# EAGLE design ratatouille (EAGLE 9.6.2)
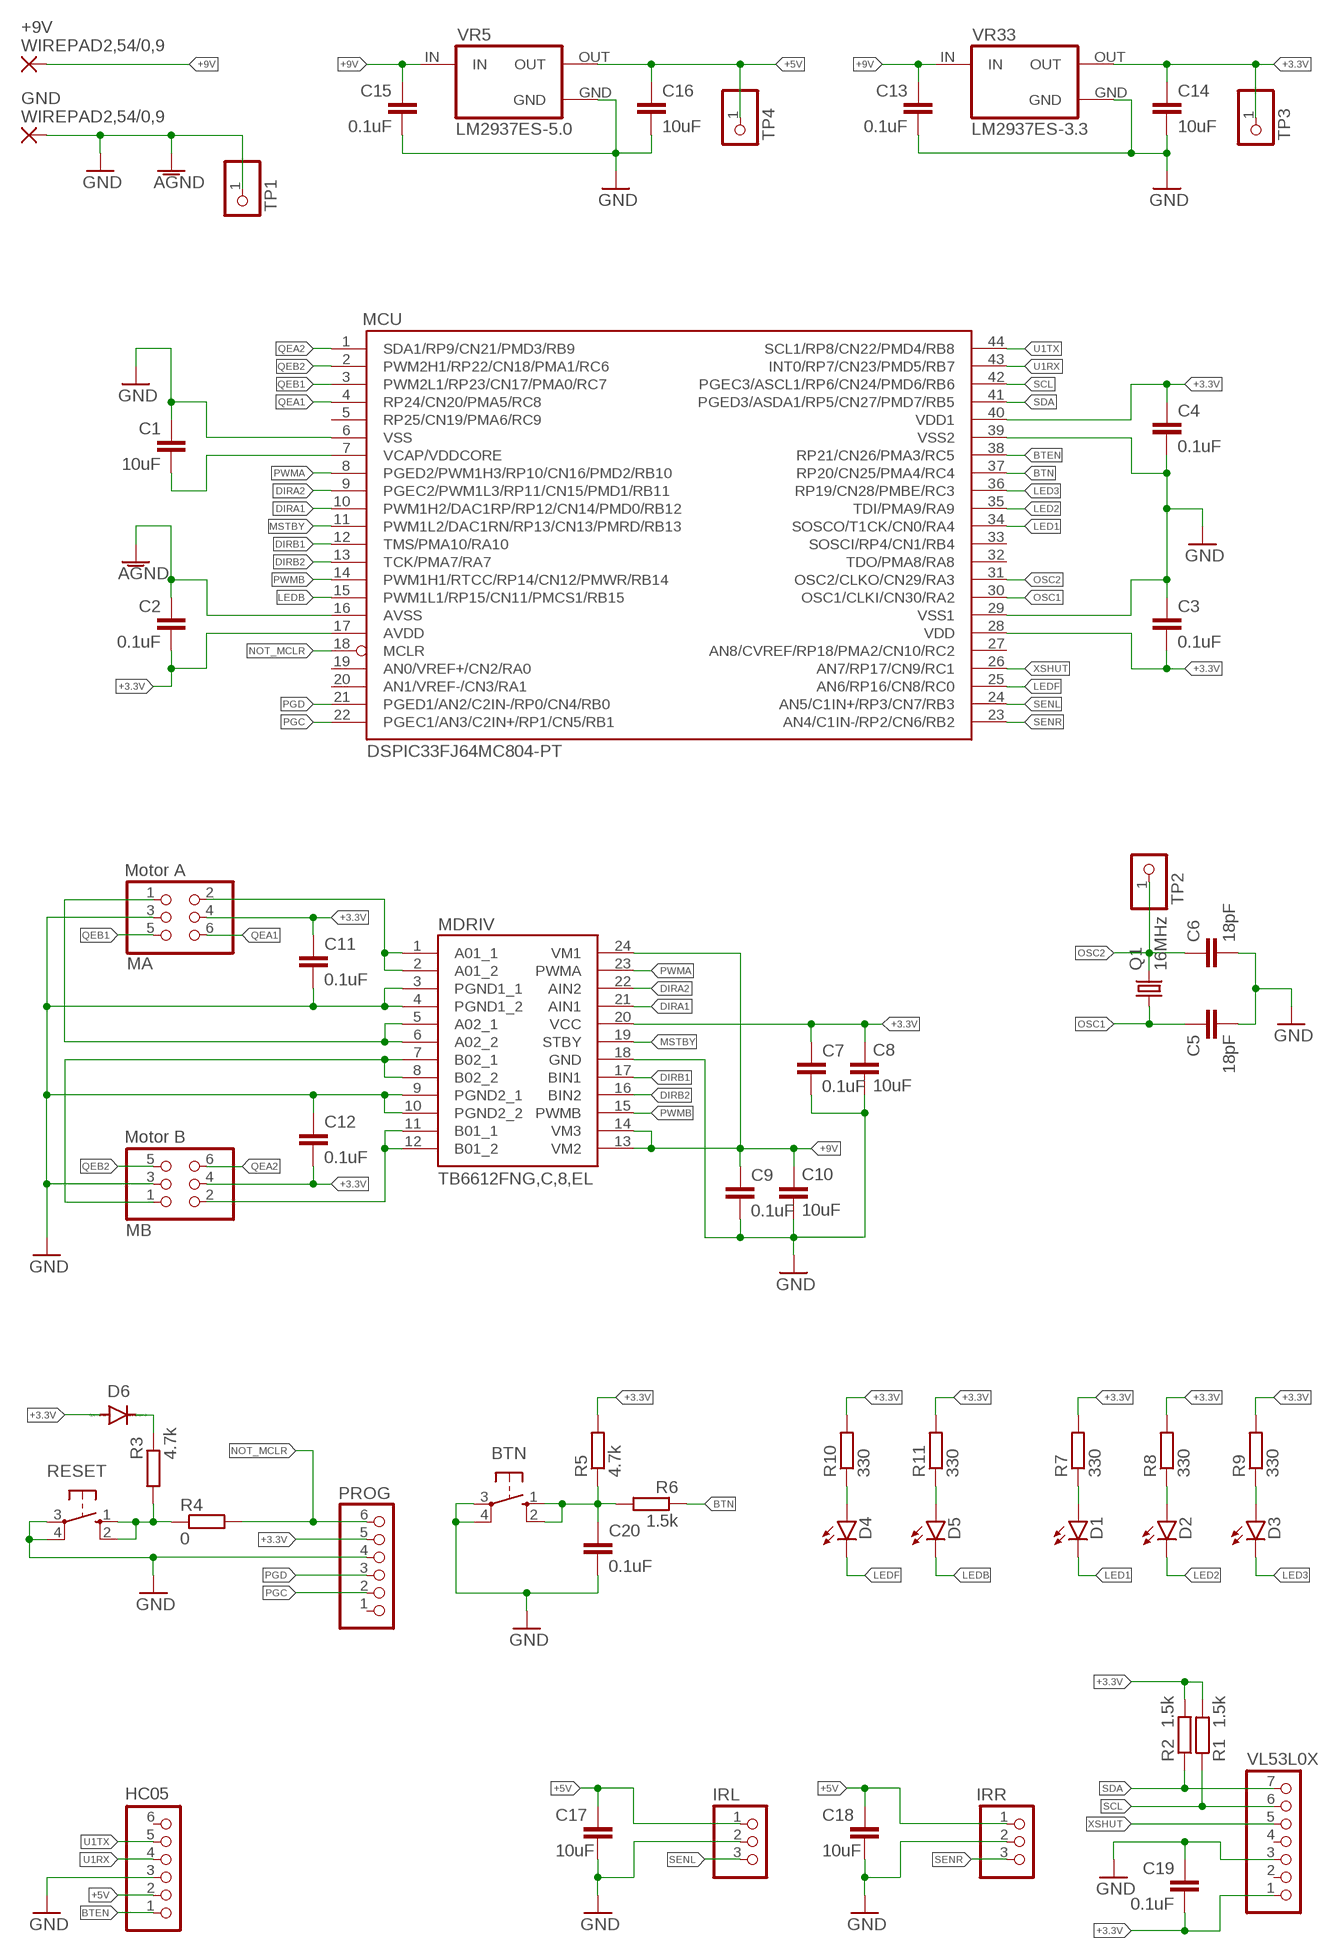
[diagram p0: schematic, sheet 1]

## Parts
+9V  WIREPAD2,54/0,9  [2,54/0,9]
BTN  10-XX  [B3F-10XX]
C1  10uF  C-EUC3216  [C3216]
C2  0.1uF  C-EUC0805  [C0805]
C3  0.1uF  C-EUC0805  [C0805]
C4  0.1uF  C-EUC0805  [C0805]
C5  18pF  C-EUC0805  [C0805]
C6  18pF  C-EUC0805  [C0805]
C7  0.1uF  C-EUC0805  [C0805]
C8  10uF  C-EUC3216  [C3216]
C9  0.1uF  C-EUC0805  [C0805]
C10  10uF  C-EUC3216  [C3216]
C11  0.1uF  C-EUC0805  [C0805]
C12  0.1uF  C-EUC0805  [C0805]
C13  0.1uF  C-EUC0805  [C0805]
C14  10uF  C-EUC3216  [C3216]
C15  0.1uF  C-EUC0805  [C0805]
C16  10uF  C-EUC3216  [C3216]
C17  10uF  C-EUC0805  [C0805]
C18  10uF  C-EUC0805  [C0805]
C19  0.1uF  C-EUC0805  [C0805]
C20  0.1uF  C-EUC0805  [C0805]
D1  LEDCHIP-LED0805  [CHIP-LED0805]
D2  LEDCHIP-LED0805  [CHIP-LED0805]
D3  LEDCHIP-LED0805  [CHIP-LED0805]
D4  LED3MM  [LED3MM]
D5  LED3MM  [LED3MM]
D6  DIODE-SOD123  [SOD123]
GND  WIREPAD2,54/0,9  [2,54/0,9]
HC05  PINHD-1X6  [1X06]
IRL  PINHD-1X3  [1X03]
IRR  PINHD-1X3  [1X03]
MA  PINHD-2X3  [2X03]
MB  PINHD-2X3  [2X03]
MCU  DSPIC33FJ64MC804-PT  [TQFP44]
MDRIV  TB6612FNG,C,8,EL  [SOP65P760X160-24N]
PROG  PINHD-1X6/90  [1X06/90]
Q1  16MHz  CRYSTALHC49U-V  [HC49U-V]
R1  1.5k  R-EU_R0805  [R0805]
R2  1.5k  R-EU_R0805  [R0805]
R3  4.7k  R-EU_R0805  [R0805]
R4  0  R-EU_R0805  [R0805]
R5  4.7k  R-EU_R0805  [R0805]
R6  1.5k  R-EU_R0805  [R0805]
R7  330  R-EU_R0805  [R0805]
R8  330  R-EU_R0805  [R0805]
R9  330  R-EU_R0805  [R0805]
R10  330  R-EU_R0805  [R0805]
R11  330  R-EU_R0805  [R0805]
RESET  10-XX  [B3F-10XX]
TP1  PINHD-1X1  [1X01]
TP2  PINHD-1X1  [1X01]
TP3  PINHD-1X1  [1X01]
TP4  PINHD-1X1  [1X01]
VL53L0X  PINHD-1X7  [1X07]
VR5  LM2937ES-5.0  [TO263]
VR33  LM2937ES-3.3  [TO263]

## Nets
+3.3V [power]: C2.1 C3.1 C4.1 C7.1 C8.1 C11.2 C12.2 C14.1 C19.1 D6.A MA.4 MB.4 MCU.17(AVDD) MCU.28(VDD) MCU.40(VDD1) MDRIV.20(VCC) PROG.5 R1.2 R2.2 R5.2 R7.2 R8.2 R9.2 R10.2 R11.2 TP3.1 VL53L0X.1 VR33.OUT
+5V [power]: C16.1 C17.1 C18.1 HC05.2 IRL.1 IRR.1 TP4.1 VR5.OUT
+9V [power]: +9V.1(P) C9.1 C10.1 C13.1 C15.1 MDRIV.13(VM2) MDRIV.14(VM3) MDRIV.24(VM1) VR5.IN VR33.IN
BTEN: HC05.1 MCU.38(RP21/CN26/PMA3/RC5)
BTN: MCU.37(RP20/CN25/PMA4/RC4) R6.1
DIRA1: MCU.10(PWM1H2/DAC1RP/RP12/CN14/PMD0/RB12) MDRIV.21(AIN1)
DIRA2: MCU.9(PGEC2/PWM1L3/RP11/CN15/PMD1/RB11) MDRIV.22(AIN2)
DIRB1: MCU.12(TMS/PMA10/RA10) MDRIV.17(BIN1)
DIRB2: MCU.13(TCK/PMA7/RA7) MDRIV.16(BIN2)
GND [power]: BTN.3(P) BTN.4(P1) C1.2 C2.2 C3.2 C4.2 C5.1 C6.1 C7.2 C8.2 C9.2 C10.2 C11.1 C12.1 C13.2 C14.2 C15.2 C16.2 C17.2 C18.2 C19.2 C20.2 GND.1(P) HC05.3 IRL.2 IRR.2 MA.3 MB.3 MCU.6(VSS) MCU.16(AVSS) MCU.29(VSS1) MCU.39(VSS2) MDRIV.3(PGND1_1) MDRIV.4(PGND1_2) MDRIV.9(PGND2_1) MDRIV.10(PGND2_2) MDRIV.18(GND) PROG.4 RESET.3(P) RESET.4(P1) TP1.1 VL53L0X.3 VR5.GND VR33.GND ; supply symbol labelled AGND
LED1: D1.C MCU.34(SOSCO/T1CK/CN0/RA4)
LED2: D2.C MCU.35(TDI/PMA9/RA9)
LED3: D3.C MCU.36(RP19/CN28/PMBE/RC3)
LEDB: D5.K(C) MCU.15(PWM1L1/RP15/CN11/PMCS1/RB15)
LEDF: D4.K(C) MCU.25(AN6/RP16/CN8/RC0)
MSTBY: MCU.11(PWM1L2/DAC1RN/RP13/CN13/PMRD/RB13) MDRIV.19(STBY)
N$1: BTN.1(S) BTN.2(S1) C20.1 R5.1 R6.2
N$2: R3.1 R4.1 RESET.1(S) RESET.2(S1)
N$3: D2.A R8.1
N$4: MA.2 MDRIV.1(A01_1) MDRIV.2(A01_2)
N$5: D1.A R7.1
N$6: MA.1 MDRIV.5(A02_1) MDRIV.6(A02_2)
N$7: D3.A R9.1
N$8: D6.C R3.2
N$9: MB.2 MDRIV.11(B01_1) MDRIV.12(B01_2)
N$10: MB.1 MDRIV.7(B02_1) MDRIV.8(B02_2)
N$11: D4.A R10.1
N$12: D5.A R11.1
NOT_MCLR: MCU.18(MCLR) PROG.6 R4.2
OSC1: C5.2 MCU.30(OSC1/CLKI/CN30/RA2) Q1.1
OSC2: C6.2 MCU.31(OSC2/CLKO/CN29/RA3) Q1.2 TP2.1
PGC: MCU.22(PGEC1/AN3/C2IN+/RP1/CN5/RB1) PROG.2
PGD: MCU.21(PGED1/AN2/C2IN-/RP0/CN4/RB0) PROG.3
PWMA: MCU.8(PGED2/PWM1H3/RP10/CN16/PMD2/RB10) MDRIV.23(PWMA)
PWMB: MCU.14(PWM1H1/RTCC/RP14/CN12/PMWR/RB14) MDRIV.15(PWMB)
QEA1: MA.6 MCU.4(RP24/CN20/PMA5/RC8)
QEA2: MB.6 MCU.1(SDA1/RP9/CN21/PMD3/RB9)
QEB1: MA.5 MCU.3(PWM2L1/RP23/CN17/PMA0/RC7)
QEB2: MB.5 MCU.2(PWM2H1/RP22/CN18/PMA1/RC6)
SCL: MCU.42(PGEC3/ASCL1/RP6/CN24/PMD6/RB6) R1.1 VL53L0X.6
SDA: MCU.41(PGED3/ASDA1/RP5/CN27/PMD7/RB5) R2.1 VL53L0X.7
SENL: IRL.3 MCU.24(AN5/C1IN+/RP3/CN7/RB3)
SENR: IRR.3 MCU.23(AN4/C1IN-/RP2/CN6/RB2)
U1RX: HC05.4 MCU.43(INT0/RP7/CN23/PMD5/RB7)
U1TX: HC05.5 MCU.44(SCL1/RP8/CN22/PMD4/RB8)
VCAP/VDDCORE: C1.1 MCU.7(VCAP/VDDCORE)
XSHUT: MCU.26(AN7/RP17/CN9/RC1) VL53L0X.5
Unconnected: HC05.6 MCU.5(RP25/CN19/PMA6/RC9) MCU.19(AN0/VREF+/CN2/RA0) MCU.20(AN1/VREF-/CN3/RA1) MCU.27(AN8/CVREF/RP18/PMA2/CN10/RC2) MCU.32(TDO/PMA8/RA8) MCU.33(SOSCI/RP4/CN1/RB4) PROG.1 VL53L0X.2 VL53L0X.4

## Notes on the sheet
- Motor A
- Motor B

## Power pins joined to a net without a drawn wire
GND: VR5.GND@(GND) VR33.GND@(GND)

## Library data of the parts
+9V GND = wirepad:WIREPAD: Wire PAD connect wire on PCB
BTN RESET = switch-omron:10-XX: OMRON SWITCH; MPN: B3F-1000; OC_FARNELL: 176432; OC_NEWARK: 36M3542
C1 = rcl:C-EU: CAPACITOR, European symbol; SPICEPREFIX: C; TYPE: ESR <5R, Ceramic or Tantalum
C2-C7 C9 C11-C13 C15 C17-C20 = rcl:C-EU: CAPACITOR, European symbol; SPICEPREFIX: C
C8 C10 = rcl:C-EU: CAPACITOR, European symbol; SPICEPREFIX: C; TYPE: tantalum, pol
C14 C16 = rcl:C-EU: CAPACITOR, European symbol; SPICEPREFIX: C; TYPE: ESR 0.01-3R, Tantalum or Ceramic
D1-D5 = led:LED: LED OSRAM: - CHIPLED LG R971, LG N971, LY N971, LG Q971, LY Q971, LO R971, LY R971 LH N974, LH R974 LS Q976, LO Q976, LY Q976 LO Q996 - Hyper CHIPLED LW Q18S LB Q993, LB Q99A, LB R99A - SideLED LS A670, LO A670, LY A670, LG A670, LP A670 LB A673, LV A673, LT A673, LW A673 LH A674 LY A675 LS A676, LA A676, LO A676, LY A676, LW A676 LS A679, LY A679, LG A679 - Hyper Micro SIDELED® LS Y876, LA Y876, LO Y876, LY Y876 LT Y87S - SmartLED LW L88C, LW L88S LB L89C, LB L89S, LG L890 LS L89K, LO L89K, LY L89K LS L896, LA L896, LO L896, LY L896 - TOPLED LS T670, LO T670, LY T670, LG T670, LP T670 LSG T670, LSP T670, LSY T670, LOP T670, LYG T670 LG T671, LOG T671, LSG T671 LB T673, LV T673, LT T673, LW T673 LH T674 LS T676, LA T676, LO T676, LY T676, LB T676, LH T676, LSB T676, LW T676 LB T67C, LV T67C, LT T67C, LS T67K, LO T67K, LY T67K, LW E67C LS E67B, LA E67B, LO E67B, LY E67B, LB E67C, LV E67C, LT E67C LW T67C LS T679, LY T679, LG T679 LS T770, LO T770, LY T770, LG T770, LP T770 LB T773, LV T773, LT T773, LW T773 LH T774 LS E675, LA E675, LY E675, LS T675 LS T776, LA T776, LO T776, LY T776, LB T776 LHGB T686 LT T68C, LB T68C - Hyper Mini TOPLED® LB M676 - Mini TOPLED Santana® LG M470 LS M47K, LO M47K, LY M47K Source: http://www.osram.convergy.de LUXEON: - LUMILED® LXK2-PW12-R00, LXK2-PW12-S00, LXK2-PW14-U00, LXK2-PW14-V00 LXK2-PM12-R00, LXK2-PM12-S00, LXK2-PM14-U00 LXK2-PE12-Q00, LXK2-PE12-R00, LXK2-PE12-S00, LXK2-PE14-T00, LXK2-PE14-U00 LXK2-PB12-K00, LXK2-PB12-L00, LXK2-PB12-M00, LXK2-PB14-N00, LXK2-PB14-P00, LXK2-PB14-Q00 LXK2-PR12-L00, LXK2-PR12-M00, LXK2-PR14-Q00, LXK2-PR14-R00 LXK2-PD12-Q00, LXK2-PD12-R00, LXK2-PD12-S00 LXK2-PH12-R00, LXK2-PH12-S00 LXK2-PL12-P00, LXK2-PL12-Q00, LXK2-PL12-R00 Source: www.luxeon.com KINGBRIGHT: KA-3528ASYC Source: www.kingbright.com
D6 = diode:DIODE-: DIODE
HC05 PROG = pinhead:PINHD-1X6: PIN HEADER
IRL IRR = pinhead:PINHD-1X3: PIN HEADER
MA MB = pinhead:PINHD-2X3: PIN HEADER
MCU = microchip-dspic33fjxxmc:DSPIC33FJ64MC804: dsPIC33FJ32MC302/304, dsPIC33FJ64MCX02/X04, AND dsPIC33FJ128MCX02/X04 High-Performance, 16-bit Digital Signal Controllers Package:44 Pin TQFP Operating Range: * Up to 40 MIPS operation (at 3.0V -3.6V): - Industrial temperature range (-40°C to +85°C) - Extended temperature range (-40°C to +125°C) High-Performance DSC CPU: * Modified Harvard architecture * C compiler optimized instruction set * 16-bit wide data path * 24-bit wide instructions * Linear program memory addressing up to 4M instruction words * Linear data memory addressing up to 64 Kbytes * 83 base instructions: mostly 1 word/1 cycle * Two 40-bit accumulators with rounding and saturation options * Flexible and powerful addressing modes: - Indirect - Modulo - Bit-Reversed * Software stack * 16 x 16 fractional/integer multiply operations * 32/16 and 16/16 divide operations * Single-cycle multiply and accumulate: - Accumulator write back for DSP operations - Dual data fetch * Up to ±16-bit shifts for up to 40-bit data Direct Memory Access (DMA): * 8-channel hardware DMA * Up to 2 Kbytes dual ported DMA buffer area (DMA RAM) to store data transferred via DMA: - Allows data transfer between RAM and a peripheral while CPU is executing code (no cycle stealing) * Most peripherals support DMA Timers/Capture/Compare/PWM: * Timer/Counters, up to five 16-bit timers: - Can pair up to make two 32-bit timers - One timer runs as a Real-Time Clock with an external 32.768 kHz oscillator - Programmable prescaler * Input Capture (up to four channels): - Capture on up, down or both edges - 16-bit capture input functions - 4-deep FIFO on each capture * Output Compare (up to four channels): - Single or Dual 16-bit Compare mode - 16-bit Glitchless PWM mode * Hardware Real-Time Clock/Calendar (RTCC): - Provides clock, calendar, and alarm functions Interrupt Controller: * 5-cycle latency * Up to 53 available interrupt sources * Up to three external interrupts * Seven programmable priority levels * Five processor exceptions Digital I/O: * Peripheral pin Select functionality * Up to 35 programmable digital I/O pins * Wake-up/Interrupt-on-Change for up to 31 pins * Output pins can drive from 3.0V to 3.6V * Up to 5V output with open drain configuration * All digital input pins are 5V tolerant * 4 mA sink on all I/O pins On-Chip Flash and SRAM: * Flash program memory (up to 128 Kbytes) * Data SRAM (up to 16 Kbytes) * Boot, Secure, and General Security for program Flash System Management: * Flexible clock options: - External, crystal, resonator, internal RC - Fully integrated Phase-Locked Loop (PLL) - Extremely low jitter PLL * Power-up Timer * Oscillator Start-up Timer/Stabilizer * Watchdog Timer with its own RC oscillator * Fail-Safe Clock Monitor * Reset by multiple sources Power Management: * On-chip 2.5V voltage regulator * Switch between clock sources in real time * Idle, Sleep, and Doze modes with fast wake-up Analog-to-Digital Converters (ADCs): * 10-bit, 1.1 Msps or 12-bit, 500 Ksps conversion: - Two and four simultaneous samples (10-bit ADC) - Up to nine input channels with auto-scanning - Conversion start can be manual or synchronized with one of four trigger sources - Conversion possible in Sleep mode - ±2 LSb max integral nonlinearity - ±1 LSb max differential nonlinearity Audio Digital-to-Analog Converter (DAC): - 16-bit Dual Channel DAC module - 100 Ksps maximum sampling rate - Second-Order Digital Delta-Sigma Modulator Comparator Module: * Two analog comparators with programmable input/output configuration CMOS Flash Technology: * Low-power, high-speed Flash technology * Fully static design * 3.3V (±10%) operating voltage * Industrial and Extended temperature * Low power consumption Motor Control Peripherals: * 6-channel 16-bit Motor Control PWM: - Three duty cycle generators - Independent or Complementary mode - Programmable dead-time and output polarity - Edge-aligned or center-aligned - Manual output override control - One Fault input - Trigger for ADC conversions - PWM frequency for 16-bit resolution (@ 40 MIPS) = 1220 Hz for Edge-Aligned mode, 610 Hz for Center-Aligned mode - PWM frequency for 11-bit resolution (@ 40 MIPS) = 39.1 kHz for Edge-Aligned mode, 19.55 kHz for Center-Aligned mode * 2-channel 16-bit Motor Control PWM: - One duty cycle generator - Independent or Complementary mode - Programmable dead time and output polarity - Edge-aligned or center-aligned - Manual output override control - One Fault input - Trigger for ADC conversions - PWM frequency for 16-bit resolution (@ 40 MIPS) = 1220 Hz for Edge-Aligned mode, 610 Hz for Center-Aligned mode - PWM frequency for 11-bit resolution (@ 40 MIPS) = 39.1 kHz for Edge-Aligned mode, 19.55 kHz for Center-Aligned mode * 2-Quadrature Encoder Interface module: - Phase A, Phase B, and index pulse input - 16-bit up/down position counter - Count direction status - Position Measurement (x2 and x4) mode - Programmable digital noise filters on inputs - Alternate 16-bit Timer/Counter mode - Interrupt on position counter rollover/underflow
MDRIV = SamacSys_Parts:TB6612FNG,C,8,EL: otor / Motion / Ignition Controllers & Drivers Brush Motor Driver IC Source: Datasheet <http://toshiba.semicon-storage.com/info/docget.jsp?did=10660&prodName=TB6612FNG>; DESCRIPTION: otor / Motion / Ignition Controllers & Drivers Brush Motor Driver IC; HEIGHT: 1.6mm; MANUFACTURER_NAME: Toshiba; MANUFACTURER_PART_NUMBER: TB6612FNG,C,8,EL; MOUSER_PART_NUMBER: 757-TB6612FNGC8EL; MOUSER_PRICE-STOCK: https://www.mouser.co.uk/ProductDetail/Toshiba/TB6612FNGC8EL?qs=rsevcuukUAy2UalRuv4E%2FQ%3D%3D
Q1 = crystal:CRYSTAL: CRYSTAL; OC_FARNELL: 1666969; OC_NEWARK: unknown
R1-R11 = rcl:R-EU_: RESISTOR, European symbol; SPICEPREFIX: R
TP1-TP4 = pinhead:PINHD-1X1: PIN HEADER
VL53L0X = pinhead:PINHD-1X7: PIN HEADER
VR5 VR33 = lm2937:LM2937ES-*: 400 and 500 mA Low Dropout Voltage Regulator NATIONAL SEMICONDUCTOR created by Peter.Hofmann@ph-tronic.de <mailto:Reter.Hofmann@ph-tronic.de> 10-2004 Rev.0

## Net classes
0 default: width 0.25 mm
1 power: width 0.5 mm
2 motor: width 1 mm

## Board
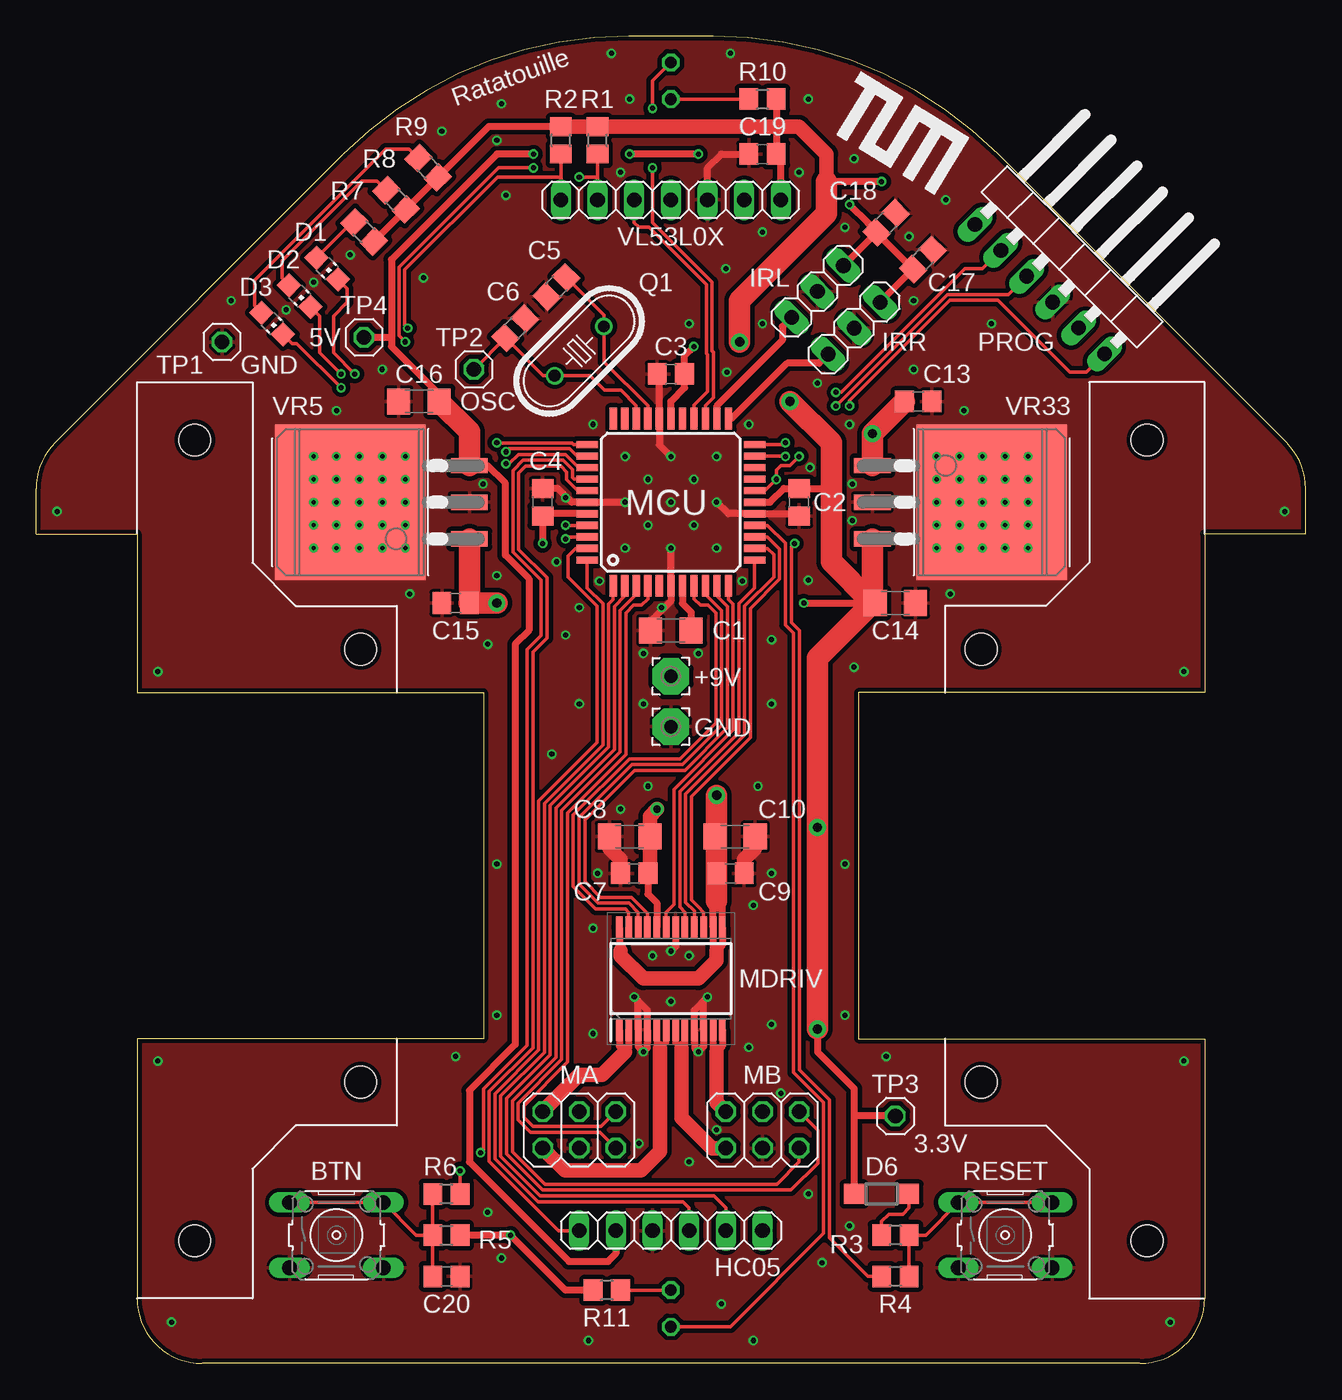
[diagram p1: board, top side]
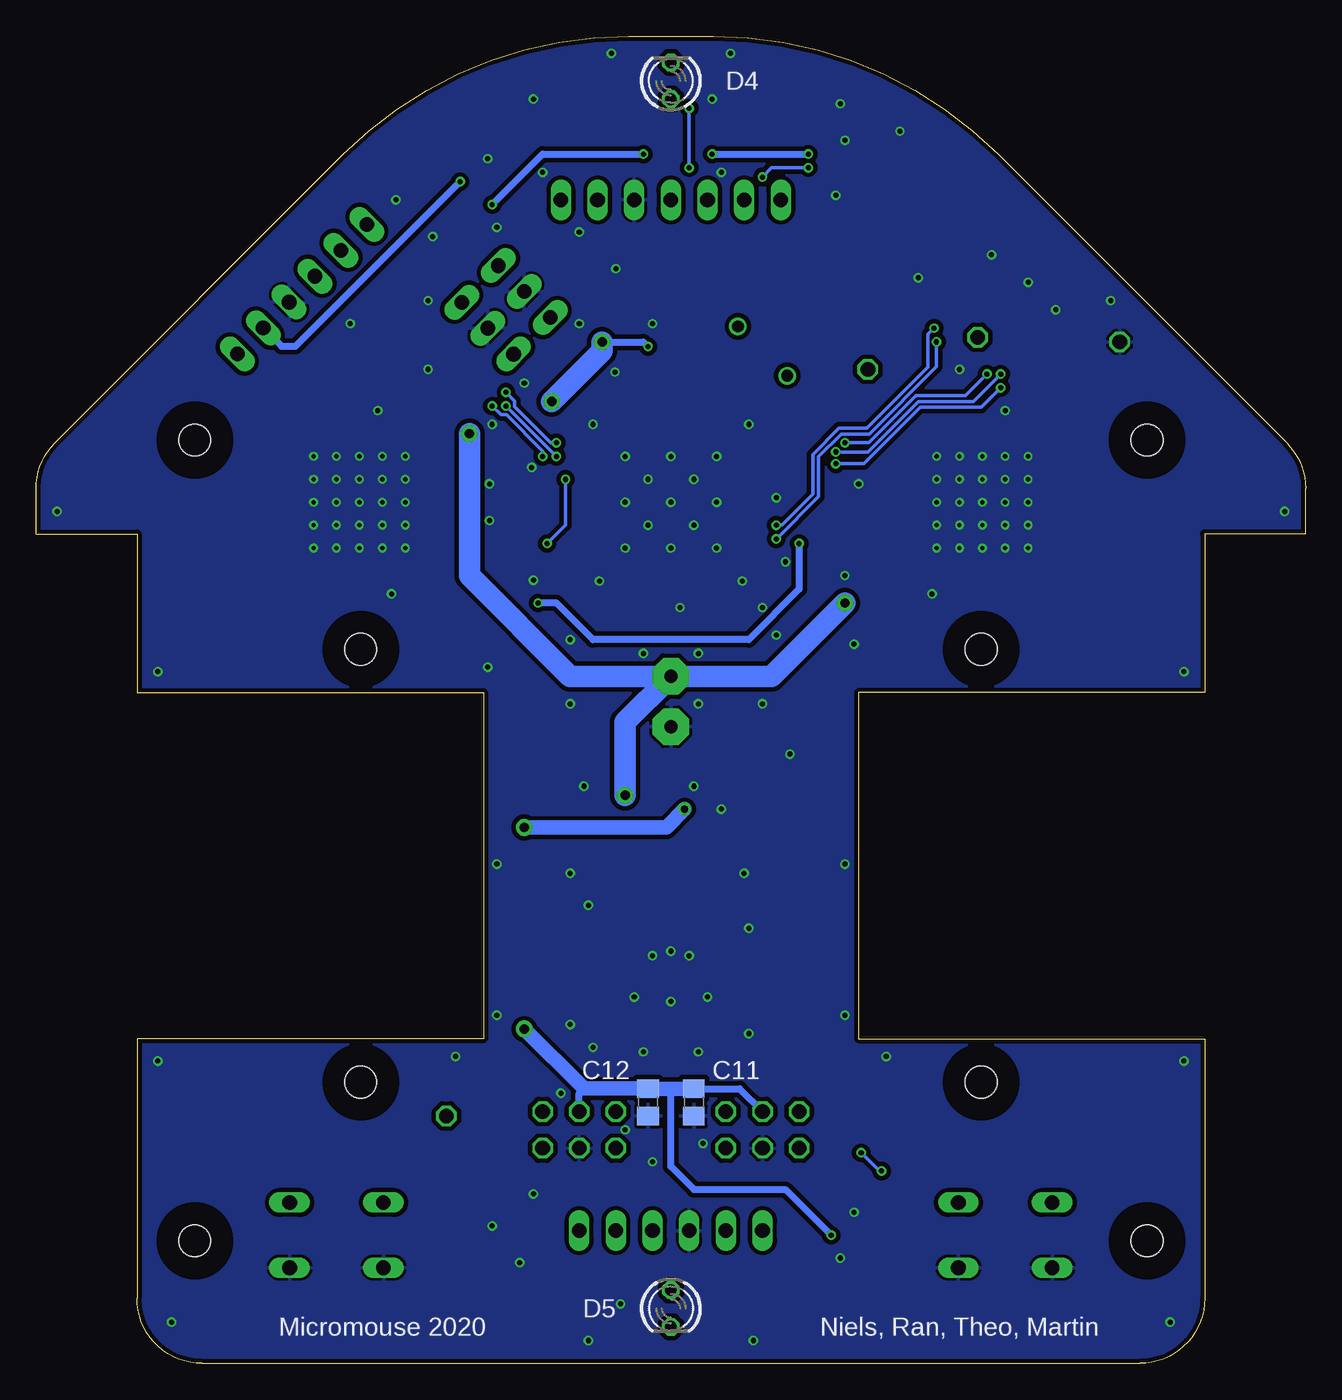
[diagram p2: board, bottom side, seen from below]

Size 88 x 92 mm. Coordinates in mm from the lower left corner, seen from the top.
Outline: 57,46.5 57,22.5 81,22.5 81,4.5 arc-90 76.5,0 11.5,0 arc-90 7,4.5 7,22.5 31,22.5 31,46.5 7,46.5 7,57.5 0,57.5 0,60.64 arc-45 1.32,63.82 21.3,83.8 arc-45 41.1,92 46.9,92 arc-45 66.7,83.8 86.68,63.82 arc-45 88,60.64 88,57.5 81,57.5 81,46.5 57,46.5
Copper layers (1*16): Top 0.035mm / dielectric 1.5mm / Bottom 0.035mm
Design rules "PCB-POOL Standard": minimum track width 0.15mm, minimum drill 0.3mm, track to track 0.15mm, track to pad 0.15mm, pad to pad 0.15mm, via to via 0.15mm, smd to smd 0.15mm, copper to edge 0.3mm, drill to drill 0.2mm, minimum pad ring 0.2mm, minimum via ring 0.15mm, stop-mask expansion 0.03mm, vias tented up to drill 0mil, thermal gap 0.2mm
Holes 2.2 mm at 11,8.5 22.5,19.5 65.5,19.5 77,8.5 22.5,49.5 11,64 77,64 65.5,49.5
bRestrict: area 63.1,47.1 to 67.8,51.9; area 74.7,6.2 to 79.3,10.8; area 74.7,61.6 to 79.3,66.3; area 63.1,17.1 to 67.8,21.9; area 8.6,6.2 to 13.4,10.8; area 20.1,17.1 to 24.9,21.9; area 8.6,61.6 to 13.4,66.3; area 20.1,47.1 to 24.9,51.9

### Footprints (pad centres in the part's own frame; a part is rotated, then mirrored left to right if it is on the bottom)
2,54/0,9 = drill 0.914 pad 2.54 octagon: 1 0,0
B3F-10XX = drill 1.016 long: 1 -3.251,2.261; 2 3.251,2.261; 3 -3.251,-2.261; 4 3.251,-2.261
C3216 = smd 1.6 x 1.8: 1 -1.4,0; 2 1.4,0
C0805 = smd 1.3 x 1.5: 1 -0.95,0; 2 0.95,0
CHIP-LED0805 = smd 1.2 x 1.2: A 0,-1.05; C 0,1.05
LED3MM = drill 0.813 octagon: A -1.27,0; K 1.27,0
SOD123 = smd 1.4 x 1.4: A 1.9,0; C -1.9,0
1X06 = drill 1.016 long: 1 -6.35,0; 2 -3.81,0; 3 -1.27,0; 4 1.27,0; 5 3.81,0; 6 6.35,0
1X03 = drill 1.016 long: 1 -2.54,0; 2 0,0; 3 2.54,0
2X03 = drill 1.016 octagon: 1 -2.54,-1.27; 2 -2.54,1.27; 3 0,-1.27; 4 0,1.27; 5 2.54,-1.27; 6 2.54,1.27
TQFP44 = smd 1.5 x 0.5: 1 -5.8,4; 2 -5.8,3.2; 3 -5.8,2.4; 4 -5.8,1.6; 5 -5.8,0.8; 6 -5.8,0; 7 -5.8,-0.8; 8 -5.8,-1.6; 9 -5.8,-2.4; 10 -5.8,-3.2; 11 -5.8,-4; 23 5.8,-4; 24 5.8,-3.2; 25 5.8,-2.4; 26 5.8,-1.6; 27 5.8,-0.8; 28 5.8,0; 29 5.8,0.8; 30 5.8,1.6; 31 5.8,2.4; 32 5.8,3.2; 33 5.8,4 | smd 0.5 x 1.5: 12 -4,-5.8; 13 -3.2,-5.8; 14 -2.4,-5.8; 15 -1.6,-5.8; 16 -0.8,-5.8; 17 0,-5.8; 18 0.8,-5.8; 19 1.6,-5.8; 20 2.4,-5.8; 21 3.2,-5.8; 22 4,-5.8; 34 4,5.8; 35 3.2,5.8; 36 2.4,5.8; 37 1.6,5.8; 38 0.8,5.8; 39 0,5.8; 40 -0.8,5.8; 41 -1.6,5.8; 42 -2.4,5.8; 43 -3.2,5.8; 44 -4,5.8
SOP65P760X160-24N = smd 1.525 x 0.45: 1 -3.562,3.575; 2 -3.562,2.925; 3 -3.562,2.275; 4 -3.562,1.625; 5 -3.562,0.975; 6 -3.562,0.325; 7 -3.562,-0.325; 8 -3.562,-0.975; 9 -3.562,-1.625; 10 -3.562,-2.275; 11 -3.562,-2.925; 12 -3.562,-3.575; 13 3.562,-3.575; 14 3.562,-2.925; 15 3.562,-2.275; 16 3.562,-1.625; 17 3.562,-0.975; 18 3.562,-0.325; 19 3.562,0.325; 20 3.562,0.975; 21 3.562,1.625; 22 3.562,2.275; 23 3.562,2.925; 24 3.562,3.575
1X06/90 = drill 1.016 long: 1 -6.35,-3.81; 2 -3.81,-3.81; 3 -1.27,-3.81; 4 1.27,-3.81; 5 3.81,-3.81; 6 6.35,-3.81
HC49U-V = drill 0.813: 1 -2.413,0; 2 2.413,0
R0805 = smd 1.3 x 1.5: 1 -0.95,0; 2 0.95,0
1X01 = drill 1.016 octagon: 1 0,0
1X07 = drill 1.016 long: 1 -7.62,0; 2 -5.08,0; 3 -2.54,0; 4 0,0; 5 2.54,0; 6 5.08,0; 7 7.62,0
TO263 = smd 1.067 x 2.54: GND 0,0; IN -2.54,0; OUT 2.54,0 | smd 10.795 x 10.414: GND@ 0,8.255

### Placement (x,y rotation side)
+9V  44,47.62 0 top
BTN  20.82,8.89 0 top
C1  44,50.8 180 top
C2  52.89,59.69 270 top
C3  44,68.58 180 top
C4  35.11,59.69 90 top
C5  36.06,74.61 45 top
C6  33.2,71.75 225 top
C7  41.46,33.97 180 top
C8  41.14,36.51 180 top
C9  48.13,33.97 0 top
C10  48.45,36.51 0 top
C11  42.41,18.1 90 bottom
C12  45.59,18.1 90 bottom
C13  61.14,66.67 0 top
C14  59.56,52.7 0 top
C15  29.08,52.7 180 top
C16  26.54,66.67 180 top
C17  61.46,76.52 45 top
C18  58.92,79.06 45 top
C19  50.35,83.82 180 top
C20  28.44,6.03 0 top
D1  20.19,75.88 225 top
D2  18.28,73.98 225 top
D3  16.38,72.07 225 top
D4  44,88.9 90 bottom
D5  44,3.81 270 bottom
D6  58.61,11.75 180 top
GND  44,44.13 0 top
HC05  44,9.21 0 top
IRL  54.16,74.3 225 top
IRR  56.7,71.75 225 top
MA  37.65,16.19 0 top
MB  50.35,16.19 0 top
MCU  44,59.69 90 top
MDRIV  44,26.67 90 top
PROG  72.26,77.15 315 top
Q1  37.65,70.17 225 top
R1  38.92,84.77 90 top
R2  36.38,84.77 90 top
R3  59.56,8.89 180 top
R4  59.56,6.03 180 top
R5  28.44,8.89 0 top
R6  28.44,11.75 180 top
R7  22.73,78.42 315 top
R8  24.95,80.64 315 top
R9  27.17,82.87 315 top
R10  50.35,87.63 0 top
R11  39.55,5.08 180 top
RESET  67.18,8.89 0 top
TP1  12.89,70.8 0 top
TP2  30.35,68.9 0 top
TP3  59.56,17.14 0 top
TP4  22.73,71.12 0 top
VL53L0X  44,80.64 180 top
VR5  30.03,59.69 90 top
VR33  57.97,59.69 270 top

### Tracks (layer width: path | path; a pad name or v marks a point on that pad's centre or on a via)
+3.3V  (via drill 0.35, 0.5, 0.65)
  Top 0.5: MCU.28 44,66.67 44.95,67.62 C3.1 44.95,69.85 v45.59,70.48 | D6.A 56.7,17.14 | v54.16,23.18 54.16,21.59 56.7,19.05 56.7,17.14 | R5.2 v32.89,8.89 36.7,5.08 R11.2 | MCU.17 50.88,59.69 51.83,60.64 C2.1 55.11,60.64 | MCU.40 35.26,58.89 C4.1 v35.11,56.83 | v53.21,52.7 C14.1 | VL53L0X.1 51.62,83.5 C19.1 51.3,85.72 R10.2 | C7.1 42.41,32.53 43.02,31.92 MDRIV.20 | R2.2 31.37,85.72 R9.2 R8.2 R7.2 | v58.61,81.92 54.8,81.92 | TP3.1 56.7,17.14
  Top 1: v43.05,38.42 42.54,37.91 C8.1 42.54,34.1 C7.1 | R2.2 R1.2 51.3,85.72 52.89,85.72 54.8,83.82 54.8,81.92
  Top 1.5: v54.16,23.18 v54.16,37.15 54.16,48.9 57.97,52.7 | VR33.OUT 57.97,52.89 C14.1 57.97,52.7 | 57.97,52.7 55.11,55.56 55.11,60.64 55.11,63.82 v52.26,66.67 | v48.76,70.8 48.76,73.66 54.8,79.69 54.8,81.92
  Bottom 0.5: v53.21,52.7 51.94,52.7 49.4,50.16 38.6,50.16 35.11,53.66 v35.11,56.83 | v32.89,8.89 36.06,12.06 42.41,12.06 44,13.65 44,19.05 | MB.4 50.35,18.73 50.03,19.05 | C11.2 39.23,19.05 MA.4 | v45.59,70.48 45.91,70.8 v48.76,70.8 | PROG.5 70.99,70.49 70.03,70.49 v58.61,81.92
  Bottom 1: v54.16,37.15 44.32,37.15 v43.05,38.42 | v54.16,23.18 50.03,19.05 C12.2 44,19.05 C11.2
  Bottom 1.5: v52.26,66.67 48.76,70.17 v48.76,70.8
+5V  (via drill 0.35)
  Top 0.5: HC05.2 40.19,7.62 39.64,7.07 36.93,7.07 30.03,13.97 30.03,18.92 33.2,22.1 33.2,49.85 34.16,50.8 34.16,54.39 32.52,56.02 32.52,61.01 31.3,62.23 VR5.OUT | IRR.1 C17.1 C18.1 | v45.91,83.82 v41.14,83.82 | C16.1 27.94,67.18 24.63,70.48 24.63,71.12 | v34.48,83.82 31.94,83.82 24.63,76.52 24.63,71.12 | TP4.1 24.63,71.12 | v56.38,80.33 57.65,79.06 C18.1 | C18.1 IRL.1
  Top 1.5: VR5.OUT 30.03,64.58 C16.1
  Bottom 0.5: v56.38,80.33 52.89,83.82 v45.91,83.82 | v41.14,83.82 v34.48,83.82
+9V  (via drill 0.65)
  Top 0.5: MDRIV.24 40.42,28.66 40.51,28.57 | MDRIV.14 46.92,28.82 47.17,28.57 47.58,28.98 MDRIV.13 47.58,31.67 47.17,32.07 46.92,31.82 MDRIV.14
  Top 1: 47.17,28.57 47.17,27.94 45.91,26.67 42.09,26.67 40.51,28.26 40.51,28.57
  Top 1.5: VR5.IN C15.1 | C15.1 | VR33.IN v57.97,64.45 C13.1 | v31.94,52.7 C15.1 | v47.17,39.37 47.17,36.51 | 47.17,36.51 C9.1 | C9.1 47.17,32.07 | C10.1 47.17,36.51 | C9.1
  Bottom 1.5: +9V.1 37.02,47.62 v31.94,52.7 | +9V.1 50.98,47.62 57.97,54.61 v57.97,64.45 | +9V.1 47.17,44.45 v47.17,39.37
BTEN
  Top 0.25: HC05.1 36.22,9.21 31.41,14.02 31.41,18.86 34.43,21.89 34.43,49.32 35.4,50.29 35.4,54.46 33.45,56.41 33.45,61.72 33.93,62.2 36.37,62.2 36.77,61.8 36.77,61.24 37.53,60.49 MCU.38
BTN  (via drill 0.35)
  Top 0.25: R6.1 v29.39,13.34 | v30.81,14.61 31.01,14.8 31.01,19.03 34.03,22.05 34.03,49.49 35,50.45 35,54.29 33.05,56.24 33.05,61.89 33.76,62.6 36.53,62.6 37.17,61.96 37.17,61.41 37.29,61.29 MCU.37
  Bottom 0.25: v30.81,14.61 29.54,13.34 v29.39,13.34
DIRA1
  Top 0.25: MDRIV.21 42.38,31.19 41.25,32.31 39.11,32.31 38.03,33.39 38.03,37.67 41.47,41.11 44.97,41.11 47.92,44.06 47.92,52.45 47.2,53.17 MCU.10
DIRA2
  Top 0.25: MDRIV.22 41.73,31.28 41.09,31.91 38.95,31.91 37.63,33.23 37.63,37.83 41.31,41.51 44.8,41.51 47.52,44.23 47.52,52.18 46.4,53.3 MCU.9
DIRB1
  Top 0.25: MCU.12 49.8,53.74 48.72,52.66 48.72,43.73 44.62,39.63 44.62,31.64 44.98,31.28 MDRIV.17
DIRB2
  Top 0.25: MDRIV.16 45.62,31.36 45.02,31.97 45.02,39.46 49.12,43.56 49.12,52.49 51.14,54.52 51.14,56.05 50.71,56.49 MCU.13
GND  (via drill 0.3, 0.35)
  Top 0.5: C3.2 43.2,68.43 MCU.29 43.2,63.66 v44,62.87 | C1.2 42.6,51.44 44,52.84 MCU.6 v44,56.52 | MDRIV.18 44.33,28.9 v44,28.57 | v40.83,59.69 MCU.39 37.12,59.69 36.17,60.64 C4.2 | v47.17,59.69 47.98,58.89 MCU.16 52.74,58.89 C2.2 | VL53L0X.3 46.54,82.87 47.49,83.82 C19.2 | MDRIV.10 46.27,25.14 v46.54,25.4 45.62,24.48 MDRIV.9 45.62,22.23 45.65,22.21 45.65,21.85 v45.91,21.59 46.27,21.96 MDRIV.10 | MDRIV.3 41.73,25.14 v41.46,25.4 42.38,24.48 MDRIV.4 42.38,22.23 42.35,22.21 42.35,21.85 v42.09,21.59 41.73,21.96 MDRIV.3
  Top 1: C7.2 40.51,34.92 39.74,35.69 C8.2 | C9.2 49.08,34.92 49.84,35.69 C10.2
  other vias: 40.83,62.87 42.41,61.28 42.41,58.1 40.83,56.52 47.17,56.52 45.59,58.1 45.59,61.28 47.17,62.87 44,59.69 42.73,28.26 45.27,28.26 44,25.08 41.78,15.24 38.6,22.86 38.6,30.16 49.72,31.75 49.4,21.91 53.52,11.75 45.27,13.97 54.48,6.99 56.38,9.53 50.03,40.01 42.41,40.01 8.44,47.94 31.3,49.85 79.56,47.94 31.94,24.13 56.06,24.13 79.56,20.95 8.44,20.95 9.39,2.86 78.61,2.86 39.05,54.23 48.95,54.23 38.6,65.09 47.17,16.19 51.62,18.73 32.25,7.3 42.09,45.72 25.59,56.52 24,56.52 22.41,56.52 20.82,56.52 19.23,56.52 19.23,58.1 20.82,58.1 22.41,58.1 24,58.1 25.59,58.1 25.59,59.69 24,59.69 22.41,59.69 20.82,59.69 19.23,59.69 19.23,61.28 19.23,62.87 20.82,62.87 22.41,62.87 24,62.87 25.59,62.87 20.82,61.28 22.41,61.28 24,61.28 25.59,61.28 62.41,62.87 64,61.28 67.18,58.1 68.77,56.52 67.18,56.52 65.59,59.69 64,59.69 62.41,61.28 62.41,59.69 62.41,58.1 62.41,56.52 64,58.1 64,56.52 65.59,56.52 65.59,58.1 67.18,59.69 68.77,59.69 68.77,58.1 67.18,61.28 67.18,62.87 68.77,62.87 68.77,61.28 65.59,62.87 65.59,61.28 64,62.87 56.57,58.42 56.57,60.96 49.4,65.09 20.82,66.04 25.9,53.34 36.7,60.01 47.87,68.71 45.27,72.07 21.77,76.83 26.86,75.25 32.57,80.96 40.51,82.55 47.81,75.88 50.35,72.07 54.16,67.94 56.06,78.74 41.14,87.63 28.12,85.41 48.13,90.81 39.87,90.81 60.83,68.9 64.32,66.04 56.38,65.09 63.37,53.34 56.7,48.26 50.98,50.16 42.09,49.21 45.91,49.21 43.37,52.39 50.98,45.72 35.74,42.23 40.51,38.42 50.98,33.97 38.92,33.97 29.08,21.27 50.98,23.5 47.49,4.13 38.28,1.59 86.55,59.05 1.45,59.05 53.65,62.1 31.3,10.48 52.89,82.55 53.52,87.63 24,68.9 19.23,74.93 17.33,73.03 32.25,87.31 31.94,84.77 56.7,83.5 63.05,80.64 60.51,78.11 66.22,72.07 60.83,73.66 13.52,73.66 49.72,1.59 30.98,60.96 31.94,54.61 37.65,45.72 36.06,55.56 36.7,50.48 37.65,52.39 31.94,34.61 50.35,78.42 53.52,54.29 56.06,34.61 58.92,21.27
  pour Bottom: 38.92,66.04 37.65,64.77 37.65,54.61 38.92,53.34 49.08,53.34 50.35,54.61 50.35,64.77 49.08,66.04
  pour Top: 39.55,64.14 39.55,55.24 48.45,55.24 48.45,64.14
  pour Top (isolate 0.305): 29.39,72.07 35.74,78.42 38.6,78.42 43.37,73.66 43.37,70.48 37.33,64.45 34.16,64.45 29.39,69.22
  pour Top (isolate 0.305, no thermals): 60.83,65.41 71.62,65.41 71.62,53.98 60.83,53.98
  pour Top (isolate 0.305, no thermals): 27.17,53.98 16.38,53.98 16.38,65.41 27.17,65.41
  pour Top (isolate 0.305): 0,60.64 0,57.5 7,57.5 7,46.5 31,46.5 31,22.5 7,22.5 7,4.5 arc90 11.5,0 76.5,0 arc90 81,4.5 81,22.5 57,22.5 57,46.5 81,46.5 81,57.5 88,57.5 88,60.64 arc45 86.68,63.82 66.7,83.8 arc45 46.9,92 41.1,92 arc45 21.3,83.8 1.32,63.82 arc45
  pour Bottom (isolate 0.305): 0,60.64 0,57.5 7,57.5 7,46.5 31,46.5 31,22.5 7,22.5 7,4.5 arc90 11.5,0 76.5,0 arc90 81,4.5 81,22.5 57,22.5 57,46.5 81,46.5 81,57.5 88,57.5 88,60.64 arc45 86.68,63.82 66.7,83.8 arc45 46.9,92 41.1,92 arc45 21.3,83.8 1.32,63.82 arc45
LED1  (via drill 0.35)
  Top 0.25: v22.09,68.58 20.61,70.06 20.61,72.6 21.57,73.55 21.57,74.5 D1.C | MCU.34 37.25,63.69 37.14,63.8 31.95,63.8 v31.94,63.82
  Bottom 0.25: v31.94,63.82 30.28,63.82 27.02,67.08 23.6,67.08 v22.09,68.58
LED2  (via drill 0.35)
  Top 0.25: v21.14,68.58 19.66,70.06 19.66,72.6 D2.C | MCU.35 37.48,62.89 36.97,63.4 32.79,63.4 v32.57,63.18
  Bottom 0.25: v32.57,63.18 30.35,63.18 26.86,66.67 23.05,66.67 v21.14,68.58
LED3  (via drill 0.35)
  Top 0.25: D3.C 17.75,70.69 18.07,70.69 v21.14,67.63 | MCU.36 37.61,62.09 36.7,63 33.43,63 32.78,62.36 v32.57,62.36
  Bottom 0.25: v32.57,62.36 30.61,62.36 26.69,66.28 22.49,66.28 v21.14,67.63
LEDB
  Top 0.25: D5.K 48.13,2.54 54.59,9 54.59,18.11 52.51,20.19 52.51,50.62 51.94,51.19 51.94,56.85 50.71,58.09 MCU.15
LEDF  (via drill 0.35)
  Top 0.25: D4.K 42.73,88.9 v42.73,87 | v42.73,82.87 42.73,79.06 46.86,74.93 46.86,70.17 46.94,70.08 46.94,66.94 46.4,66.4 MCU.25
  Bottom 0.25: v42.73,87 v42.73,82.87
MSTBY
  Top 0.25: MCU.11 48,52.94 48.32,52.62 48.32,43.9 44.22,39.79 44.22,31.82 43.67,31.28 MDRIV.19
N$1
  Top 0.25: BTN.1 BTN.2 26.33,8.89 R5.1 | R5.1 C20.1 | R6.2 R5.1
N$2
  Top 0.25: RESET.2 RESET.1 61.67,8.89 R3.1 R4.1
N$3
  Top 0.25: D2.A 17.05,75.21 17.05,76.42 22.58,81.95 23.65,81.95 R8.1
N$4
  Top 0.45: MDRIV.2 41.08,22.23
  Top 0.5: MDRIV.1 40.42,21.99 40.83,21.59 41.08,21.84 41.08,22.23
  Top 1: MA.2 35.11,17.48 37.64,20 39.24,20 40.83,21.59
N$5
  Top 0.25: D1.A 21.91,79.09 R7.1
N$6
  Top 0.45: MDRIV.6 43.67,22.26 43.25,21.84 43.02,22.07 MDRIV.5
  Top 1: 43.25,21.84 43.25,14.71 41.92,13.38 36.65,13.38 MA.1
N$7
  Top 0.25: D3.A 15.15,73.3 15.15,75.08 24.23,84.17 25.87,84.17 R9.1
N$8
  Top 0.25: R3.2 58.61,9.85 59.11,10.35 60.07,10.35 60.51,10.79 D6.C
N$9
  Top 0.45: MDRIV.11 46.92,22.23
  Top 0.5: 46.92,22.23 46.92,21.84 47.17,21.59 47.58,21.99 MDRIV.12
  Top 1: MB.2 47.17,18.1 47.17,21.59
N$10
  Top 0.45: MDRIV.8 44.98,22.07 44.75,21.84 44.33,22.26 MDRIV.7
  Top 1: MB.1 46.86,14.92 44.75,17.03 44.75,21.84
N$11
  Top 0.25: D4.A R10.1
N$12
  Top 0.25: R11.1 D5.A
NOT_MCLR  (via drill 0.35)
  Top 0.25: R4.2 57.65,6.03 54.99,8.69 54.99,18.27 52.91,20.35 52.91,50.79 52.34,51.36 52.34,56.6 v52.57,56.83 | v56.38,66.36 56.38,66.74 63.33,73.69 66.67,73.69 71.66,68.7 72.78,68.7 PROG.6 | MCU.18 50.52,60.49 v51.3,61.28 51.3,61.91 51.62,62.23 52.26,62.23 v52.89,62.87
  Bottom 0.25: v52.89,62.87 52.89,63.25 55.4,65.76 55.78,65.76 v56.38,66.36 | v52.57,56.83 51.3,58.1 v51.3,61.28
OSC1
  Top 0.25: C5.2 39.36,72.66 Q1.1 39.36,69.41 42.4,66.37 MCU.30
OSC2
  Top 0.25: MCU.31 41.6,66.4 40.53,67.47 39.4,67.47 38.4,68.46 Q1.2 35.16,68.46 C6.2 TP2.1
PGC  (via drill 0.35)
  Top 0.25: MCU.22 51.81,63.69 v51.94,63.82 | v55.43,67.31 55.82,67.31 64.39,75.88 65.6,75.88 PROG.2
  Bottom 0.25: v51.94,63.82 52.32,63.82 54.83,66.32 54.83,66.71 v55.43,67.31
PGD  (via drill 0.35)
  Top 0.25: MCU.21 51.91,62.89 v51.94,62.87 | PROG.3 67.39,74.09 63.16,74.09 v55.43,66.36
  Bottom 0.25: v55.43,66.36 v51.94,62.87
PWMA
  Top 0.25: MDRIV.23 41.08,31.28 40.84,31.51 38.78,31.51 37.23,33.06 37.23,38 41.14,41.91 44.63,41.91 47.12,44.39 47.12,52.02 46.59,52.55 46.04,52.55 45.6,52.98 MCU.8
PWMB
  Top 0.25: MDRIV.15 46.27,31.28 45.91,31.65 45.42,32.13 45.42,39.3 49.52,43.4 49.52,52.33 51.54,54.35 51.54,56.45 50.71,57.29 MCU.14
QEA1
  Top 0.25: MA.6 39.15,16.42 34.44,16.42 33.81,17.05 33.81,17.87 36.83,20.89 36.83,38.17 40.88,42.22 40.88,52.02 41.41,52.55 41.96,52.55 42.4,52.98 MCU.4
QEA2
  Top 0.25: MCU.1 40,52.94 39.68,52.62 39.68,42.71 35.63,38.66 35.63,21.39 32.61,18.37 32.61,14.52 35.11,12.02 52.33,12.02 54.19,13.88 54.19,16.16 MB.6
QEB1
  Top 0.25: MA.5 39.09,16.02 34.28,16.02 33.41,16.89 33.41,18.04 36.43,21.06 36.43,38.33 40.48,42.38 40.48,52.18 41.6,53.3 MCU.3
QEB2
  Top 0.25: MB.5 52.89,13.97 51.34,12.42 35.27,12.42 33.01,14.68 33.01,18.2 36.03,21.22 36.03,38.5 40.08,42.55 40.08,52.45 40.8,53.17 MCU.2
SCL  (via drill 0.35)
  Top 0.25: 38.92,82.23 R1.1 | MCU.42 36.84,57.29 v36.7,57.15 | v25.59,70.8 25.16,71.23 25.16,75.98 32.04,82.87 v34.48,82.87 | 38.92,82.23 v37.65,82.23 | VL53L0X.6 38.92,82.23
  Bottom 0.25: v36.7,57.15 33.76,60.09 33.76,62.84 32.18,64.42 30.24,64.42 25.59,69.08 v25.59,70.8 | v37.65,82.23 37.02,82.87 v34.48,82.87
SDA  (via drill 0.35)
  Top 0.25: VL53L0X.7 36.38,82.23 | 36.38,82.23 R2.1 | MCU.41 v36.71,58.09 v36.7,58.1 | v25.76,71.75 25.56,71.95 25.56,75.82 31.97,82.23 36.38,82.23
  Bottom 0.25: v36.7,58.1 36.31,58.1 34.16,60.26 34.16,63.01 32.35,64.82 30.41,64.82 26.18,69.04 26.18,71.33 v25.76,71.75
SENL
  Top 0.5: MCU.24 47.2,66.38 51.73,70.91 51.73,71.86 IRL.3
SENR
  Top 0.5: MCU.23 48.21,65.49 52.05,69.32 54.27,69.32 IRR.3
U1RX
  Top 0.25: HC05.4 45.27,10.79 44.85,11.22 34.78,11.22 31.81,14.18 31.81,18.7 34.83,21.72 34.83,38.99 38.88,43.04 38.88,52.49 36.86,54.52 36.86,55.97 37.38,56.49 MCU.43
U1TX
  Top 0.25: MCU.44 38.2,53.74 39.28,52.66 39.28,42.88 35.23,38.83 35.23,21.55 32.21,18.53 32.21,14.35 34.94,11.62 46.99,11.62 47.81,10.79 HC05.5
VCAP/VDDCORE
  Top 0.5: MCU.7 44.8,52.67 45.4,52.07 C1.1
XSHUT
  Top 0.25: VL53L0X.5 41.46,79.06 41.78,78.74 42.48,78.74 46.46,74.76 46.46,70 46.54,69.92 46.54,67.35 45.6,66.41 MCU.26

### Text on the board
tPlace: Ratatouille | GND | 5V | OSC | 3.3V
bPlace: Niels, Ran, Theo, Martin | Micromouse 2020